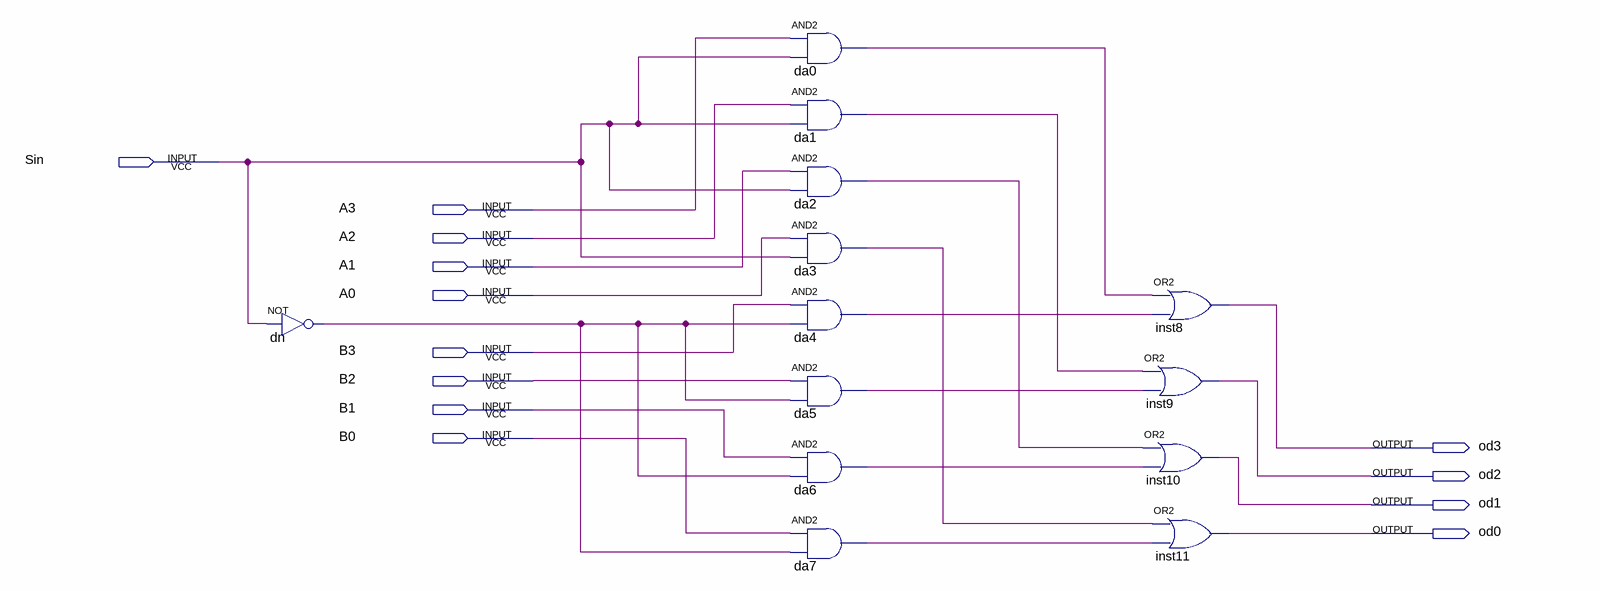
[diagram p0: schematic sheet]
// Quartus schematic mux.bdf as structural Verilog: 13 symbols, 13 pins
module mux (
  input  Sin,
  input  A3,
  input  A2,
  input  A1,
  input  A0,
  input  B3,
  input  B2,
  input  B1,
  input  B0,
  output od3,
  output od2,
  output od1,
  output od0
);

  wire da0_out, da1_out, da2_out, da3_out, da4_out, da5_out, da6_out, da7_out, dn_out;

  not dn (dn_out, Sin);
  and da0 (da0_out, A3, Sin);
  and da1 (da1_out, A2, Sin);
  and da2 (da2_out, A1, Sin);
  and da3 (da3_out, A0, Sin);
  and da4 (da4_out, B3, dn_out);
  and da5 (da5_out, B2, dn_out);
  and da6 (da6_out, B1, dn_out);
  and da7 (da7_out, B0, dn_out);
  or inst8 (od3, da0_out, da4_out);
  or inst9 (od2, da1_out, da5_out);
  or inst10 (od1, da2_out, da6_out);
  or inst11 (od0, da3_out, da7_out);
endmodule
